# EAGLE design  DCmotorBreadBoard (EAGLE 9.6.2)
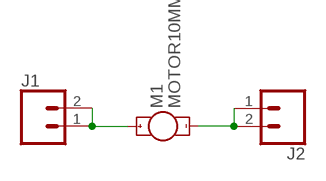
[diagram p0: schematic, sheet 1]

## Parts
J1  CONN_02  [1X02]
J2  CONN_02  [1X02]
M1  MOTOR10MM  [VIBE-MOTOR-10MM]

## Nets
N$1: J1.1 J1.2 M1.+
N$2: J2.1 J2.2 M1.-

## Library data of the parts
J1 J2 = SparkFun-Connectors:CONN_02: Multi connection point. Often used as Generic Header-pin footprint for 0.1 inch spaced/style header connections On any of the 0.1 inch spaced packages, you can populate with these: Break Away Headers - Straight <https://www.sparkfun.com/products/116> (PRT-00116) Break Away Male Headers - Right Angle <https://www.sparkfun.com/products/553> (PRT-00553) Female Headers <https://www.sparkfun.com/products/115> (PRT-00115) Break Away Headers - Machine Pin <https://www.sparkfun.com/products/117> (PRT-00117) Break Away Female Headers - Swiss Machine Pin <https://www.sparkfun.com/products/743> (PRT-00743) For SCREWTERMINALS and SPRING TERMINALS visit here: Screw Terimnals on SparkFun.com <https://www.sparkfun.com/search/results?term=Screw+Terminals> (5mm/3.5mm/2.54mm spacing) This device is also useful as a general connection point to wire up your design to another part of your project. Our various solder wires solder well into these plated through hole pads. Hook-Up Wire - Assortment (Stranded, 22 AWG) <https://www.sparkfun.com/products/11375> (PRT-11375) Hook-Up Wire - Assortment (Solid Core, 22 AWG) <https://www.sparkfun.com/products/11367> (PRT-11367) View the entire wire category on our website here <https://www.sparkfun.com/categories/141> Special notes: Molex polarized connector foot print use with: PRT-08233 with associated crimp pins and housings. 2.54_SCREWTERM for use with PRT-10571. 3.5mm Screw Terminal footprints for PRT-08084 5mm Screw Terminal footprints for use with PRT-08432
M1 = SparkFun-Electromechanical:MOTOR: Motor (Single-Phase) Two-terminal, single-phase motors. SparkFun Products Vibration Motor <https://www.sparkfun.com/products/8449> (ROB-08449) Physical dimension and wire connections for this powerful vibration motor. Motor has a self adhesive backing.; PROD_ID: COMP-08572; SF_SKU: ROB-08449

## Board
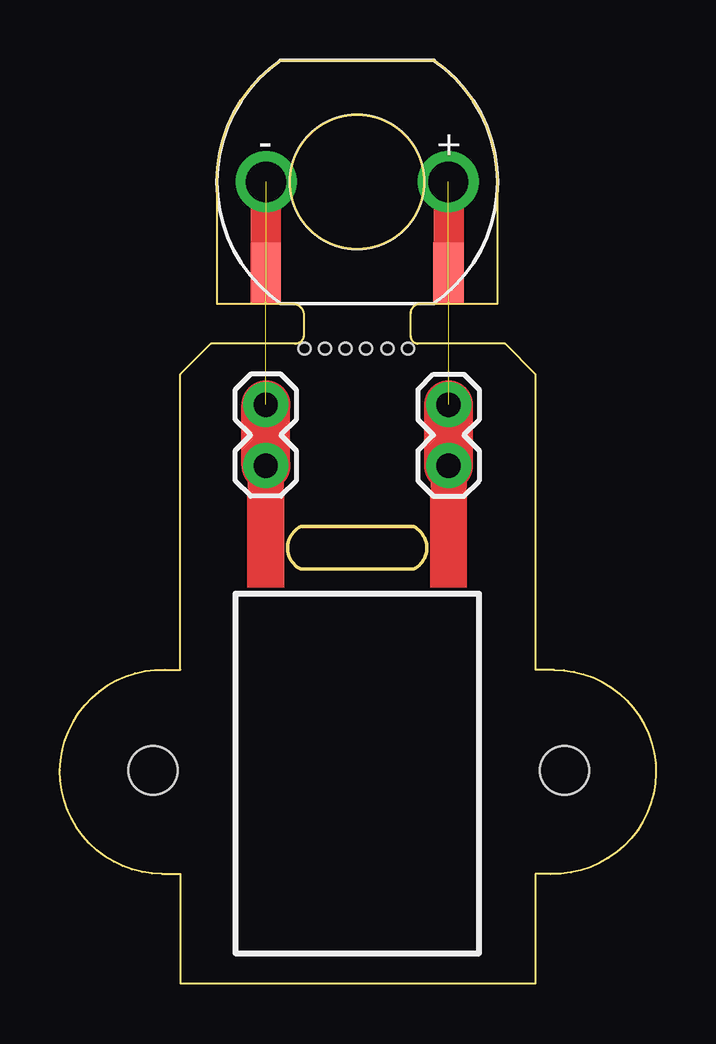
[diagram p1: board, top side]
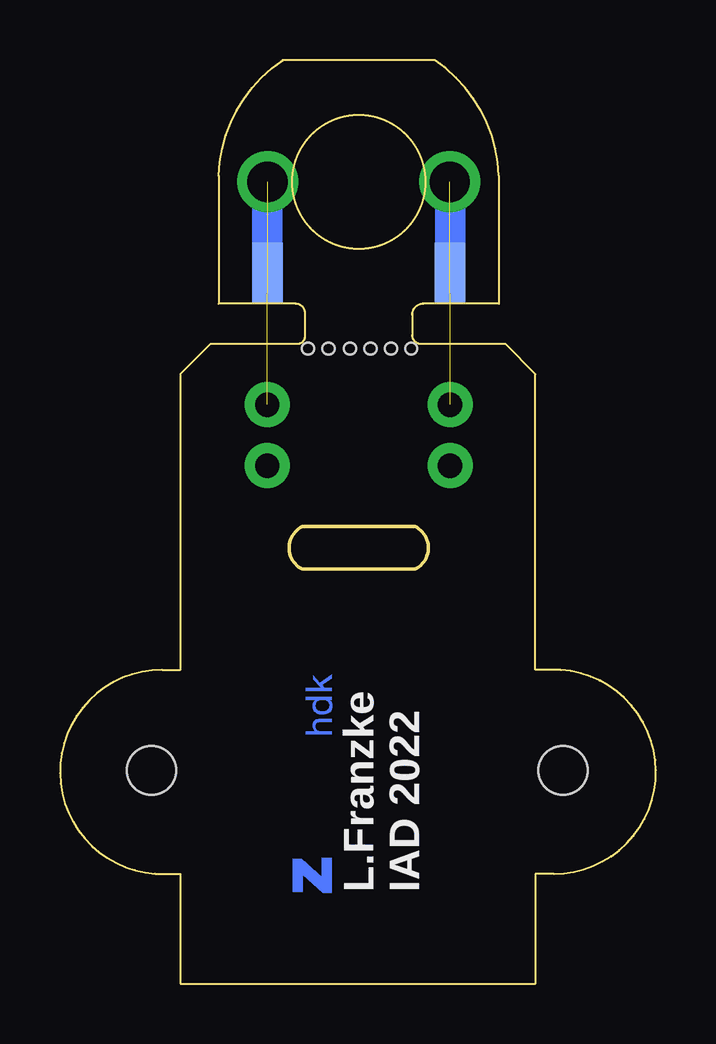
[diagram p2: board, bottom side, seen from below]

Size 24.83 x 38.5 mm. Coordinates in mm from the lower left corner, seen from the top.
Outline: 5.02,25.4 6.29,26.67 9.79,26.67 arc90 10.16,27.04 10.16,27.87 arc90 9.69,28.34 6.54,28.34 6.54,33.67 arc-53 9.21,38.5 15.56,38.5 arc-53 18.22,33.67 18.22,28.34 15.02,28.34 arc90 14.62,27.94 14.62,26.98 arc90 14.92,26.67 18.54,26.67 19.81,25.4 19.81,13.08 20.57,13.08 arc-182 20.45,4.57 19.81,4.57 19.81,0 5.02,0 5.02,4.57 4.25,4.57 arc-182 4.38,13.08 5.02,13.08 5.02,25.4
Outline: 10.03,19.05 14.73,19.05 arc-127 14.73,17.27 10.03,17.27 arc-127 10.03,19.05
Outline: circle at 12.38,33.42 radius 2.78
Copper layers (1*16): Top 0.035mm / dielectric 1.5mm / Bottom 0.035mm
Design rules "default": minimum track width 6mil, minimum drill 0.35mm, track to track 6mil, track to pad 6mil, pad to pad 6mil, via to via 6mil, smd to smd 6mil, copper to edge 40mil, drill to drill 6mil, minimum pad ring 10mil, minimum via ring 8mil, stop-mask expansion 4mil, vias tented up to drill 0mil, thermal gap 10mil
Holes 0.5 mm at 10.19,26.47 11.04,26.47 11.89,26.47 12.74,26.47 13.64,26.47 14.49,26.47
Holes 2.03 mm at 3.87,8.89 21.02,8.89

### Footprints (pad centres in the part's own frame; a part is rotated, then mirrored left to right if it is on the bottom)
1X02 = drill 1.016 pad 1.88: 1 0,0; 2 2.54,0
VIBE-MOTOR-10MM = drill 1.676 pad 2.54: + 3.797,0; - -3.797,0 | smd 1.27 x 2.54: P$1 -3.81,-3.81; P$2 3.81,-3.81 | smd 1.27 x 2.54 bottom: P$3 -3.81,-3.81; P$4 3.81,-3.81

### Placement (x,y rotation side)
J1  16.19,21.59 90 top
J2  8.57,24.13 270 top
M1  12.38,33.42 0 top
U$1  [ZHDK_LOGO]  15.68,3.05 90 bottom

### Tracks (layer width: path | path; a pad name or v marks a point on that pad's centre or on a via)
N$1  (1 unrouted)
  Top 1.524: J1.1 16.19,20.78
  Top 2.032: J1.1 J1.2
N$2  (1 unrouted)
  Top 1.524: J2.1 8.57,20.78
  Top 2.032: J2.2 J2.1
(copper drawn outside any net)
  shapes: Top area x2

### Text on the board
bNames: IAD 2022 | L.Franzke